# Altium schematic sheet STM32H7 Board.SchDoc
size C; SheetNumber: 1; SheetTotal: 4
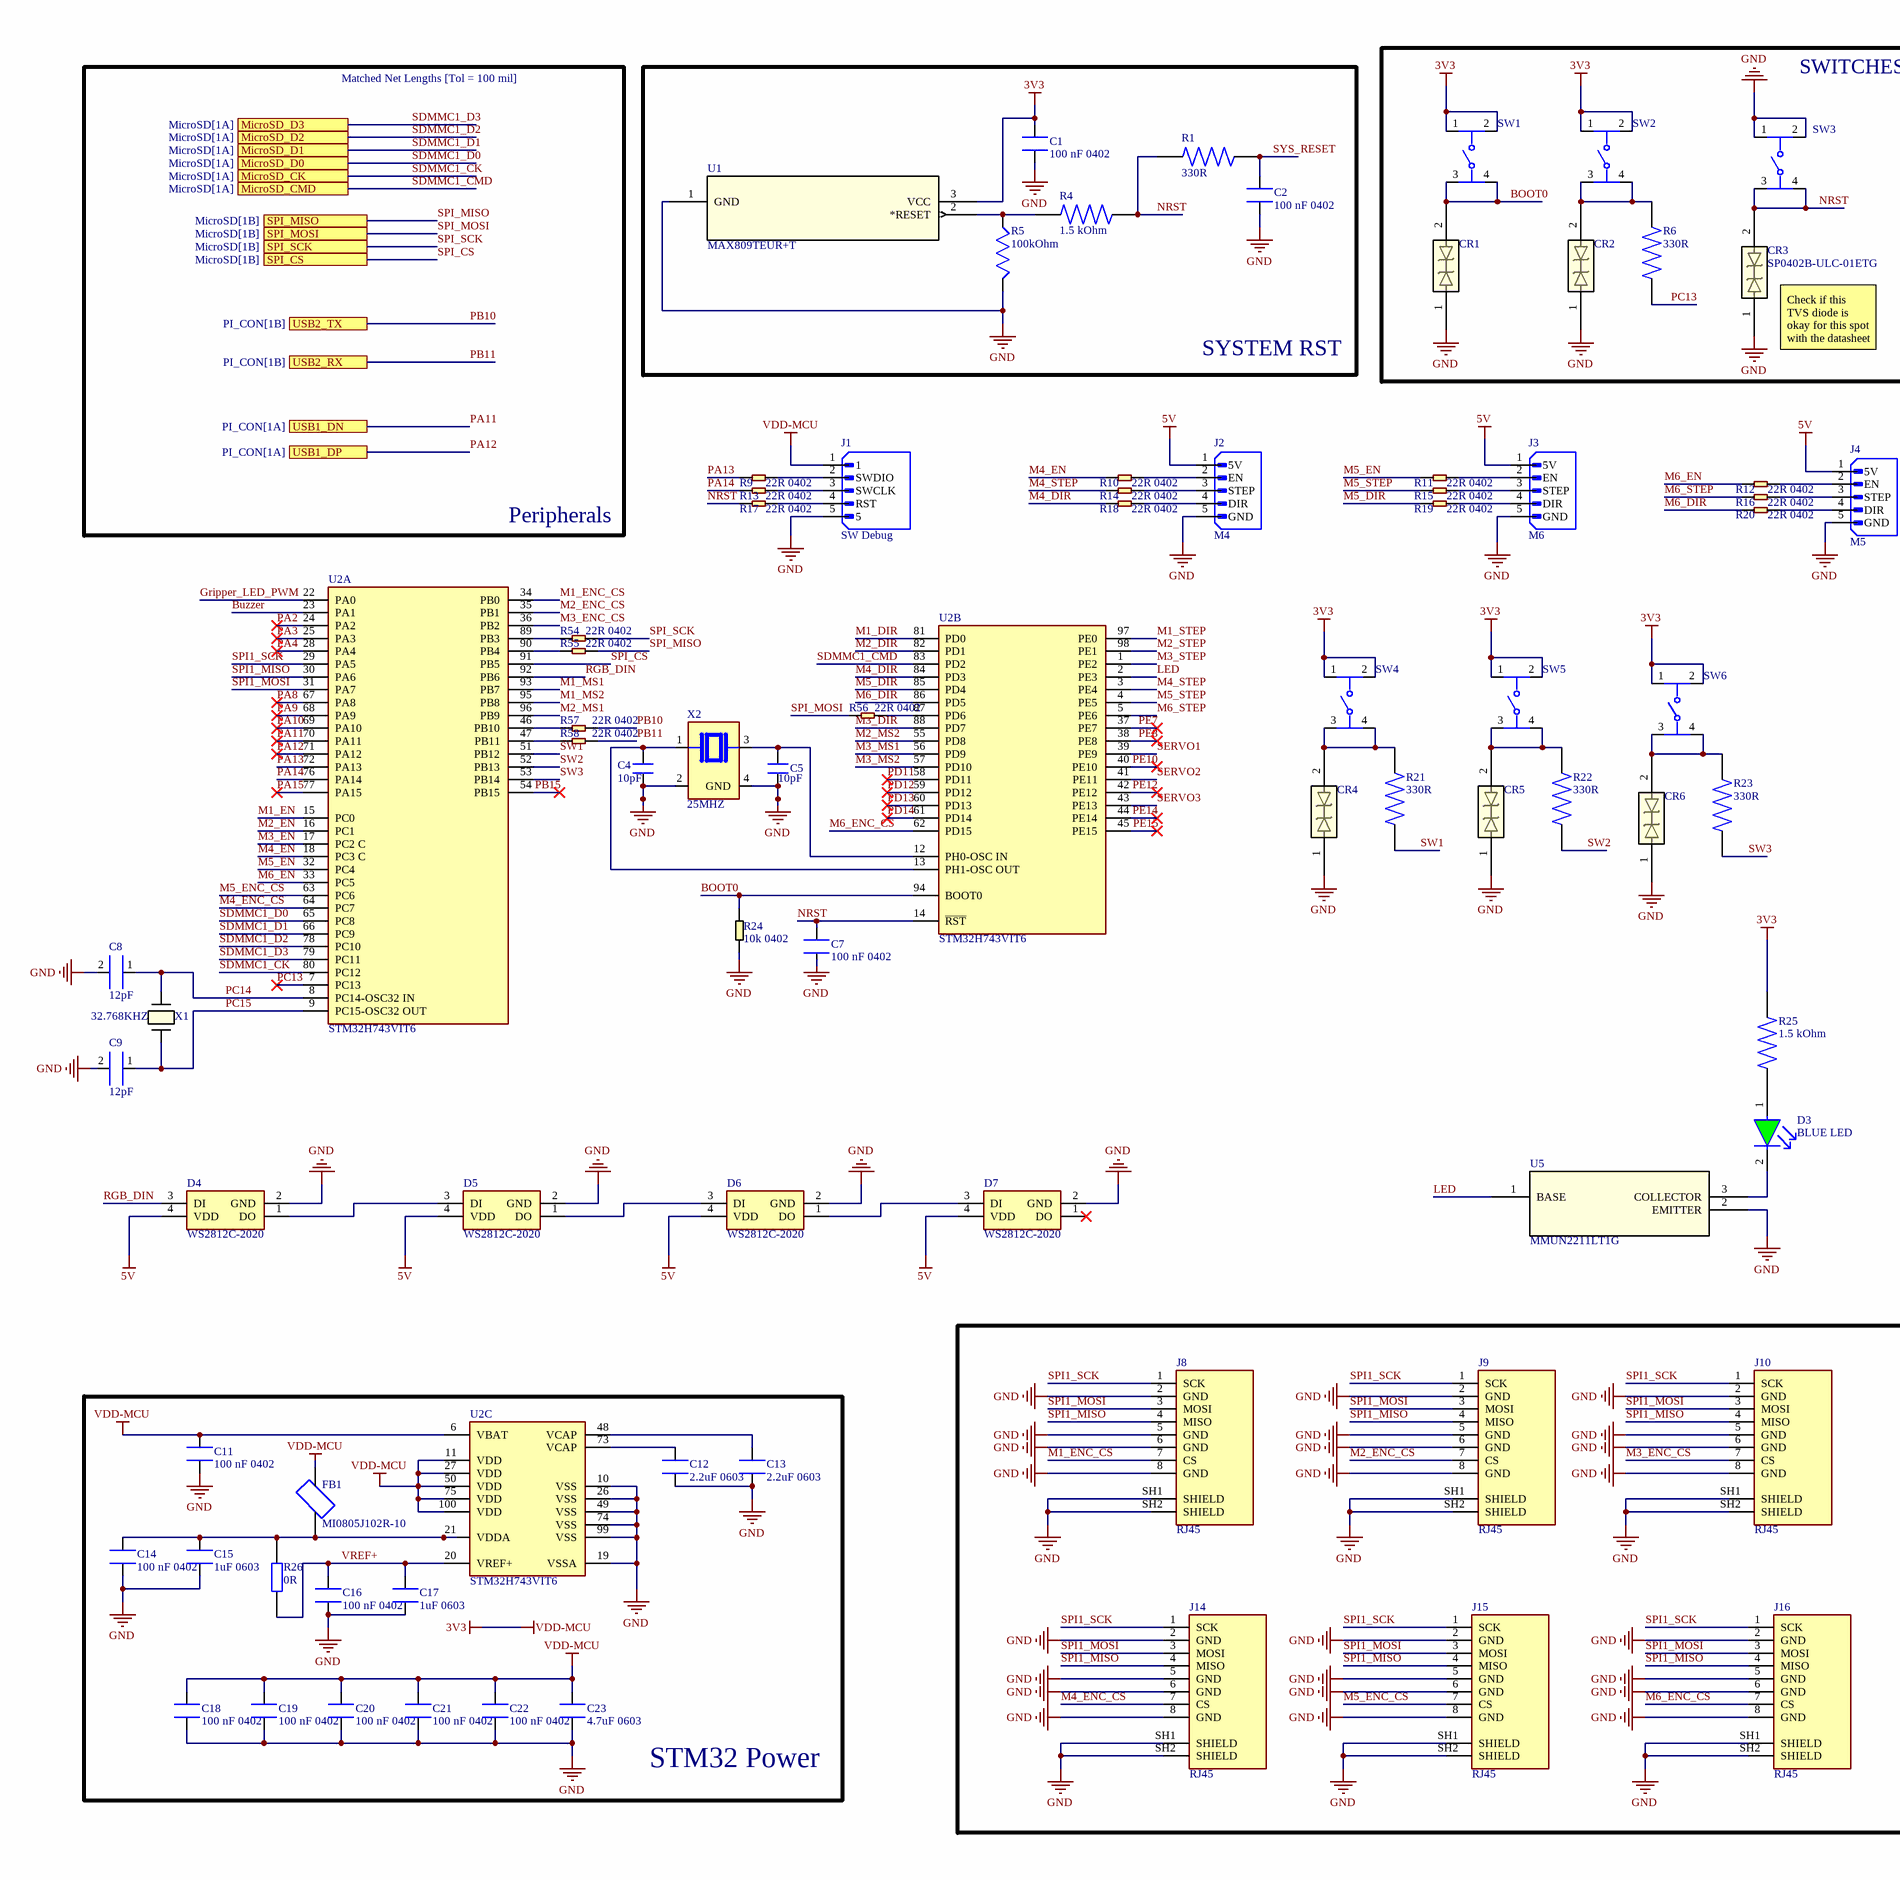
[diagram p0: STM32H7 Board.SchDoc, left]
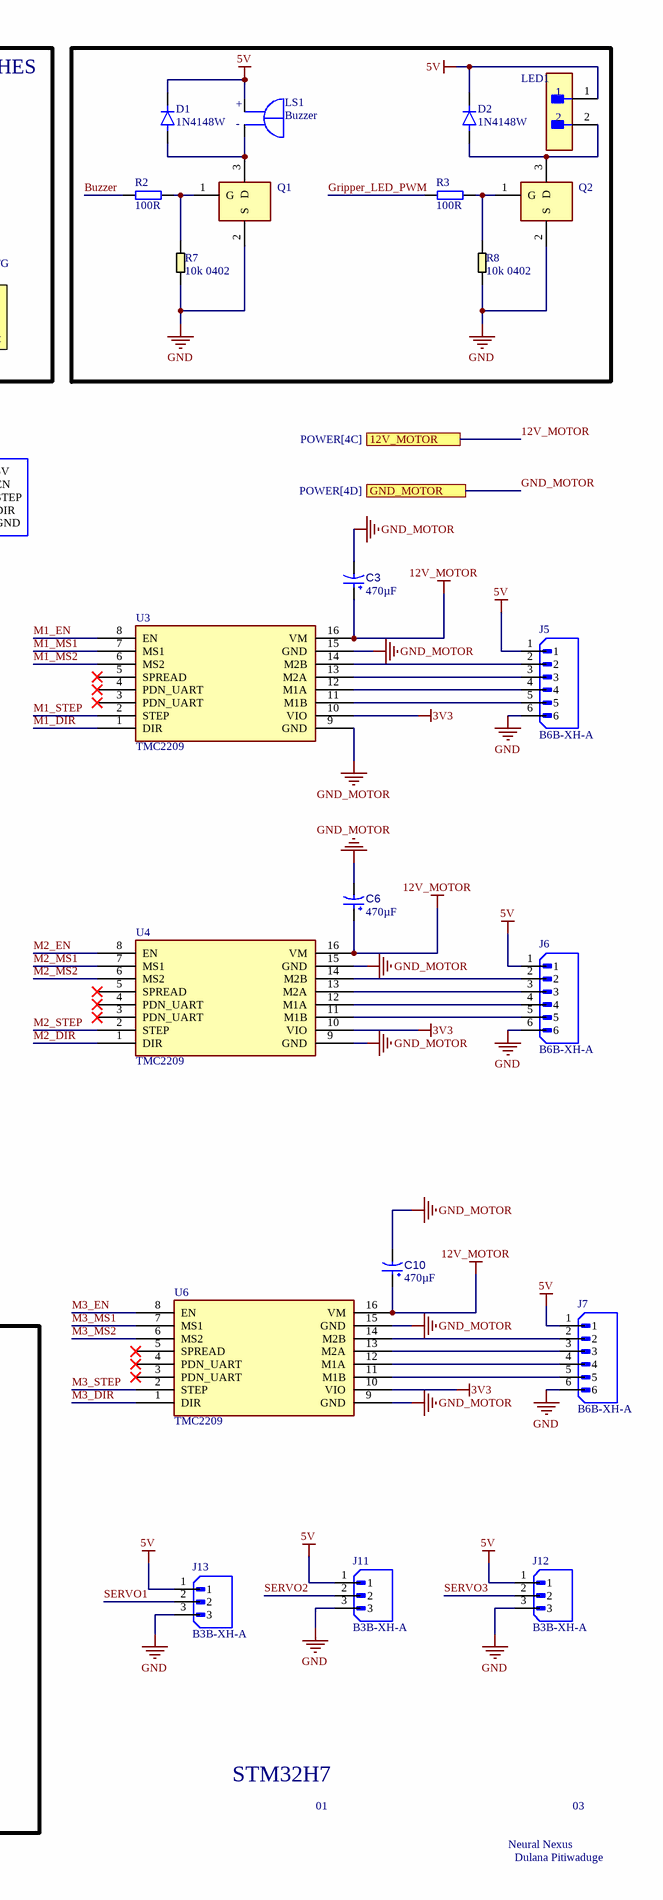
[diagram p1: STM32H7 Board.SchDoc, right]

## Parts
C1  100 nF 0402  [CAPC1005X55N]
C2  100 nF 0402  [CAPC1005X55N]
C3  value 470µF  [CAPPR65-500-2000X1000X2200]  (hidden comment: ECA-1HM471)
C4  10pF  [CAPC1005X55N]
C5  10pF  [CAPC1005X55N]
C6  value 470µF  [CAPPR65-500-2000X1000X2200]  (hidden comment: ECA-1HM471)
C7  100 nF 0402  [CAPC1005X55N]
C8  12pF  [CAPC1005X55N]
C9  12pF  [CAPC1005X55N]
C10  value 470µF  [CAPPR65-500-2000X1000X2200]  (hidden comment: ECA-1HM471)
C11  100 nF 0402  [CAPC1005X55N]
C12  2.2uF 0603  [CAPC1608X90]
C13  2.2uF 0603  [CAPC1608X90]
C14  100 nF 0402  [CAPC1005X55N]
C15  1uF 0603  [CAPC1608X90]
C16  100 nF 0402  [CAPC1005X55N]
C17  1uF 0603  [CAPC1608X90]
C18  100 nF 0402  [CAPC1005X55N]
C19  100 nF 0402  [CAPC1005X55N]
C20  100 nF 0402  [CAPC1005X55N]
C21  100 nF 0402  [CAPC1005X55N]
C22  100 nF 0402  [CAPC1005X55N]
C23  4.7uF 0603  [CAP_CC0603_YAG]
CR1  SP0402B-ULC-01ETG  [SP0402_LTF]  (value not drawn)
CR2  SP0402B-ULC-01ETG  [SP0402_LTF]  (value not drawn)
CR3  SP0402B-ULC-01ETG  [SP0402_LTF]
CR4  SP0402B-ULC-01ETG  [SP0402_LTF]  (value not drawn)
CR5  SP0402B-ULC-01ETG  [SP0402_LTF]  (value not drawn)
CR6  SP0402B-ULC-01ETG  [SP0402_LTF]  (value not drawn)
D1  1N4148W  [SODFL3816X120N]
D2  1N4148W  [SODFL3816X120N]
D3  BLUE LED  [FP-SML-LX0805SRC-TR-MFG]
D4  WS2812C-2020  [WS2812C2020]
D5  WS2812C-2020  [WS2812C2020]
D6  WS2812C-2020  [WS2812C2020]
D7  WS2812C-2020  [WS2812C2020]
FB1  MI0805J102R-10  [FB_MI0805J102R-10]
J1  SW Debug  [61300511121]
J2  M4  [JST_B5B-XH-A]
J3  M6  [JST_B5B-XH-A]
J4  M5  [JST_B5B-XH-A]
J5  B6B-XH-A  [JST_B6B-XH-A]
J6  B6B-XH-A  [JST_B6B-XH-A]
J7  B6B-XH-A  [JST_B6B-XH-A]
J8  RJ45  [AMPHENOL_RJHSE5380]
J9  RJ45  [AMPHENOL_RJHSE5380]
J10  RJ45  [AMPHENOL_RJHSE5380]
J11  B3B-XH-A  [JST_B3B-XH-A]
J12  B3B-XH-A  [JST_B3B-XH-A]
J13  B3B-XH-A  [JST_B3B-XH-A]
J14  RJ45  [AMPHENOL_RJHSE5380]
J15  RJ45  [AMPHENOL_RJHSE5380]
J16  RJ45  [AMPHENOL_RJHSE5380]
LED1  B2B-XH-A(LF)(SN)  [FP-B2B-XH-A_LF_SN-MFG]  (value not drawn)
LS1  Buzzer  [XDCR_KPEG242-5V]
Q1  2N7002LT3G  [SOT96P237X111-3N]  (value not drawn)
Q2  2N7002LT3G  [SOT96P237X111-3N]  (value not drawn)
R1  330R  [RESC1005X40N]
R2  100R  [RESC1005X40]
R3  100R  [RESC1005X40]
R4  1.5 kOhm  [RESC1005X40N]
R5  100kOhm  [RESC1005X40]
R6  330R  [RESC1005X40N]
R7  10k 0402  [RESC1005X40N]
R8  10k 0402  [RESC1005X40N]
R9  22R 0402  [R0402]
R10  22R 0402  [R0402]
R11  22R 0402  [R0402]
R12  22R 0402  [R0402]
R13  22R 0402  [R0402]
R14  22R 0402  [R0402]
R15  22R 0402  [R0402]
R16  22R 0402  [R0402]
R17  22R 0402  [R0402]
R18  22R 0402  [R0402]
R19  22R 0402  [R0402]
R20  22R 0402  [R0402]
R21  330R  [RESC1005X40N]
R22  330R  [RESC1005X40N]
R23  330R  [RESC1005X40N]
R24  10k 0402  [RESC1005X40N]
R25  1.5 kOhm  [RESC1005X40N]
R26  0R  [RESC1608X55N]
R54  22R 0402  [R0402]
R55  22R 0402  [R0402]
R56  22R 0402  [R0402]
R57  22R 0402  [R0402]
R58  22R 0402  [R0402]
SW1  TS-1089S-02526  [SKRPANE010]  (value not drawn)
SW2  TS-1089S-02526  [SKRPANE010]  (value not drawn)
SW3  TS-1089S-02526  [SKRPANE010]  (value not drawn)
SW4  TS-1089S-02526  [SKRPANE010]  (value not drawn)
SW5  TS-1089S-02526  [SKRPANE010]  (value not drawn)
SW6  TS-1089S-02526  [SKRPANE010]  (value not drawn)
U1  MAX809TEUR+T  [21-0051H_MXM]
U2  STM32H743VIT6  [FP-LQFP100-1L-MFG]  (parts A,B,C of 3)
U3  TMC2209  [TMC2209]
U4  TMC2209  [TMC2209]
U5  MMUN2211LT1G  [SOT-23-3_1P4X3P040_ONS]
U6  TMC2209  [TMC2209]
X1  32.768KHZ  [XTAL_ABS07-32.768KHZ-7-T_ABR]
X2  25MHZ  [XTAL_ABM8G-25.000MHZ-B4Y-T]

## Blocks framed on the sheet
SYSTEM RST: C1 C2 R1 R4 R5 U1
SWITCHES: CR1-CR3 R6 SW1-SW3
STM32 Power: C11-C23 FB1 R26 U2

## Ports
12V_MOTOR (see POWER[4C]), GND_MOTOR (see POWER[4D]), MicroSD_CK (see MicroSD[1A]), MicroSD_CMD (see MicroSD[1A]), MicroSD_D0 (see MicroSD[1A]), MicroSD_D1 (see MicroSD[1A]), MicroSD_D2 (see MicroSD[1A]), MicroSD_D3 (see MicroSD[1A]), SPI_CS (see MicroSD[1B]), SPI_MISO (see MicroSD[1B]), SPI_MOSI (see MicroSD[1B]), SPI_SCK (see MicroSD[1B]), USB1_DN (see PI_CON[1A]), USB1_DP (see PI_CON[1A]), USB2_RX (see PI_CON[1B]), USB2_TX (see PI_CON[1B])

## Nets
3V3: C1.2 C11.2 C18.2 C19.2 C20.2 C21.2 C22.2 C23.2 FB1.2 J1.1 R25.2 SW1.1 SW1.2 SW2.1 SW2.2 SW4.1 SW4.2 SW5.1 SW5.2 SW6.1 SW6.2 U1.3(VCC) U2.6(VBAT) U2.11(VDD) U2.27(VDD) U2.50(VDD) U2.75(VDD) U2.100(VDD) U3.10(VIO) U4.10(VIO) U6.10(VIO)  [also labelled VDD-MCU]
5V: D1.C(K) D2.C(K) D4.4(VDD) D5.4(VDD) D6.4(VDD) D7.4(VDD) J2.1(5V) J3.1(5V) J4.1(5V) J5.1 J6.1 J7.1 J11.1 J12.1 J13.1 LED1.1 LS1.P(POS)
12V_MOTOR: C3.1 C6.1 C10.1 U3.16(VM) U4.16(VM) U6.16(VM) ; port 12V_MOTOR
GND: C1.1 C2.1 C4.2 C5.2 C7.1 C8.2 C9.2 C11.1 C12.2 C13.2 C14.1 C15.2 C16.1 C17.2 C18.1 C19.1 C20.1 C21.1 C22.1 C23.1 CR1.1 CR2.1 CR3.1 CR4.1 CR5.1 CR6.1 D4.2(GND) D5.2(GND) D6.2(GND) D7.2(GND) J1.5 J2.5(GND) J3.5(GND) J4.5(GND) J5.6 J6.6 J7.6 J8.2(GND) J8.5(GND) J8.6(GND) J8.8(GND) J8.SH1(SHIELD) J8.SH2(SHIELD) J9.2(GND) J9.5(GND) J9.6(GND) J9.8(GND) J9.SH1(SHIELD) J9.SH2(SHIELD) J10.2(GND) J10.5(GND) J10.6(GND) J10.8(GND) J10.SH1(SHIELD) J10.SH2(SHIELD) J11.3 J12.3 J13.3 J14.2(GND) J14.5(GND) J14.6(GND) J14.8(GND) J14.SH1(SHIELD) J14.SH2(SHIELD) J15.2(GND) J15.5(GND) J15.6(GND) J15.8(GND) J15.SH1(SHIELD) J15.SH2(SHIELD) J16.2(GND) J16.5(GND) J16.6(GND) J16.8(GND) J16.SH1(SHIELD) J16.SH2(SHIELD) Q1.2(S) Q2.2(S) R5.1 R7.1 R8.1 R24.1 SW3.1 SW3.2 U1.1(GND) U2.10(VSS) U2.19(VSSA) U2.26(VSS) U2.49(VSS) U2.74(VSS) U2.99(VSS) U5.2(EMITTER) X2.2(GND) X2.4(GND)
GND_MOTOR: C3.2 C6.2 C10.2 U3.9(GND) U3.15(GND) U4.9(GND) U4.15(GND) U6.9(GND) U6.15(GND) ; port GND_MOTOR
BOOT0: CR1.2 R24.2 SW1.3 SW1.4 U2.94(BOOT0)
Buzzer: R2.1 U2.23(PA1)
Gripper_LED_PWM: R3.1 U2.22(PA0)
LED: U2.2(PE3) U5.1(BASE)
M1_DIR: U2.81(PD0) U3.1(DIR)
M1_EN: U2.15(PC0) U3.8(EN)
M1_ENC_CS: J8.7(CS) U2.34(PB0)
M1_MS1: U2.93(PB7) U3.7(MS1)
M1_MS2: U2.95(PB8) U3.6(MS2)
M1_STEP: U2.97(PE0) U3.2(STEP)
M2_DIR: U2.82(PD1) U4.1(DIR)
M2_EN: U2.16(PC1) U4.8(EN)
M2_ENC_CS: J9.7(CS) U2.35(PB1)
M2_MS1: U2.96(PB9) U4.7(MS1)
M2_MS2: U2.55(PD8) U4.6(MS2)
M2_STEP: U2.98(PE1) U4.2(STEP)
M3_DIR: U2.88(PD7) U6.1(DIR)
M3_EN: U2.17(PC2_C) U6.8(EN)
M3_ENC_CS: J10.7(CS) U2.36(PB2)
M3_MS1: U2.56(PD9) U6.7(MS1)
M3_MS2: U2.57(PD10) U6.6(MS2)
M3_STEP: U2.1(PE2) U6.2(STEP)
M4_DIR: R18.1 U2.84(PD3)
M4_EN: R10.1 U2.18(PC3_C)
M4_ENC_CS: J14.7(CS) U2.64(PC7)
M4_STEP: R14.1 U2.3(PE4)
M5_DIR: R19.1 U2.85(PD4)
M5_EN: R11.1 U2.32(PC4)
M5_ENC_CS: J15.7(CS) U2.63(PC6)
M5_STEP: R15.1 U2.4(PE5)
M6_DIR: R20.1 U2.86(PD5)
M6_EN: R12.1 U2.33(PC5)
M6_ENC_CS: J16.7(CS) U2.62(PD15)
M6_STEP: R16.1 U2.5(PE6)
NRST: C7.2 CR3.2 R1.1 R4.2 R17.1 SW3.3 SW3.4 U2.14(~{RST})
PA2: U2.24(PA2)
PA3: U2.25(PA3)
PA4: U2.28(PA4)
PA8: U2.67(PA8)
PA9: U2.68(PA9)
PA10: U2.69(PA10)
PA11: U2.70(PA11) ; port USB1_DN
PA12: U2.71(PA12) ; port USB1_DP
PA13: R9.1 U2.72(PA13)
PA14: R13.1 U2.76(PA14)
PA15: U2.77(PA15)
PB10: R57.2 ; port USB2_TX
PB11: R58.2 ; port USB2_RX
PB15: U2.54(PB15)
PC13: R6.1 U2.7(PC13)
PC14: C8.1 U2.8(PC14-OSC32_IN) X1.2
PC15: C9.1 U2.9(PC15-OSC32_OUT) X1.1
PD11: U2.58(PD11)
PD12: U2.59(PD12)
PD13: U2.60(PD13)
PD14: U2.61(PD14)
PE7: U2.37(PE7)
PE8: U2.38(PE8)
PE10: U2.40(PE10)
PE12: U2.42(PE12)
PE14: U2.44(PE14)
PE15: U2.45(PE15)
RGB_DIN: D4.3(DI) U2.92(PB6)
SDMMC1_CK: U2.80(PC12) ; port MicroSD_CK
SDMMC1_CMD: U2.83(PD2) ; port MicroSD_CMD
SDMMC1_D0: U2.65(PC8) ; port MicroSD_D0
SDMMC1_D1: U2.66(PC9) ; port MicroSD_D1
SDMMC1_D2: U2.78(PC10) ; port MicroSD_D2
SDMMC1_D3: U2.79(PC11) ; port MicroSD_D3
SERVO1: J13.2 U2.39(PE9)
SERVO2: J11.2 U2.41(PE11)
SERVO3: J12.2 U2.43(PE13)
SPI1_MISO: J8.4(MISO) J9.4(MISO) J10.4(MISO) J14.4(MISO) J15.4(MISO) J16.4(MISO) U2.30(PA6)
SPI1_MOSI: J8.3(MOSI) J9.3(MOSI) J10.3(MOSI) J14.3(MOSI) J15.3(MOSI) J16.3(MOSI) U2.31(PA7)
SPI1_SCK: J8.1(SCK) J9.1(SCK) J10.1(SCK) J14.1(SCK) J15.1(SCK) J16.1(SCK) U2.29(PA5)
SPI_CS: U2.91(PB5) ; port SPI_CS
SPI_MISO: R55.2 ; port SPI_MISO
SPI_MOSI: R56.1 ; port SPI_MOSI
SPI_SCK: R54.2 ; port SPI_SCK
SW1: R21.1 U2.51(PB12)
SW2: R22.1 U2.52(PB13)
SW3: R23.1 U2.53(PB14)
SYS_RESET: C2.2 R1.2
VREF+: C16.2 C17.1 R26.1 U2.20(VREF+)
NetC4_1: C4.1 U2.13(PH1-OSC_OUT) X2.1
NetC5_1: C5.1 U2.12(PH0-OSC_IN) X2.3
NetC12_1: C12.1 U2.73(VCAP)
NetC13_1: C13.1 U2.48(VCAP)
NetC14_2: C14.2 C15.1 FB1.1 R26.2 U2.21(VDDA)
NetCR2_2: CR2.2 R6.2 SW2.3 SW2.4
NetCR4_2: CR4.2 R21.2 SW4.3 SW4.4
NetCR5_2: CR5.2 R22.2 SW5.3 SW5.4
NetCR6_2: CR6.2 R23.2 SW6.3 SW6.4
NetD1_A: D1.A LS1.N(NEG) Q1.3(D)
NetD2_A: D2.A LED1.2 Q2.3(D)
NetD3_1: D3.1(A) R25.1
NetD3_2: D3.2(C) U5.3(COLLECTOR)
NetD4_1: D4.1(DO) D5.3(DI)
NetD5_1: D5.1(DO) D6.3(DI)
NetD6_1: D6.1(DO) D7.3(DI)
NetJ1_2: J1.2(SWDIO) R9.2
NetJ1_3: J1.3(SWCLK) R13.2
NetJ1_4: J1.4(RST) R17.2
NetJ2_2: J2.2(EN) R10.2
NetJ2_3: J2.3(STEP) R14.2
NetJ2_4: J2.4(DIR) R18.2
NetJ3_2: J3.2(EN) R11.2
NetJ3_3: J3.3(STEP) R15.2
NetJ3_4: J3.4(DIR) R19.2
NetJ4_2: J4.2(EN) R12.2
NetJ4_3: J4.3(STEP) R16.2
NetJ4_4: J4.4(DIR) R20.2
NetJ5_2: J5.2 U3.14(M2B)
NetJ5_3: J5.3 U3.13(M2A)
NetJ5_4: J5.4 U3.12(M1A)
NetJ5_5: J5.5 U3.11(M1B)
NetJ6_2: J6.2 U4.14(M2B)
NetJ6_3: J6.3 U4.13(M2A)
NetJ6_4: J6.4 U4.12(M1A)
NetJ6_5: J6.5 U4.11(M1B)
NetJ7_2: J7.2 U6.14(M2B)
NetJ7_3: J7.3 U6.13(M2A)
NetJ7_4: J7.4 U6.12(M1A)
NetJ7_5: J7.5 U6.11(M1B)
NetQ1_1: Q1.1(G) R2.2 R7.2
NetQ2_1: Q2.1(G) R3.2 R8.2
NetR4_1: R4.1 R5.2 U1.2(*RESET)
NetR54_1: R54.1 U2.89(PB3)
NetR55_1: R55.1 U2.90(PB4)
NetR56_2: R56.2 U2.87(PD6)
NetR57_1: R57.1 U2.46(PB10)
NetR58_1: R58.1 U2.47(PB11)

Not connected (* = marked no-connect by the designer): D7 1(DO)*; U3 3(PDN_UART)* 4(PDN_UART)* 5(SPREAD)*; U4 3(PDN_UART)* 4(PDN_UART)* 5(SPREAD)*; U6 3(PDN_UART)* 4(PDN_UART)* 5(SPREAD)*

## Notes on the sheet
- Matched Net Lengths [Tol = 100 mil]
- (near CR3) Check if this TVS diode is okay for this spot with the datasheet
- Peripherals
- STM32H7
- 01
- Neural Nexus
- Dulana Pitiwaduge
- 03
- (in symbol KPEG242-5V) +; -

## Library data of the parts
C1 C2 C7 C11 C14 C16 C18-C22 = CL05B104KP5NNNC: 0.1 ÂµF Â±10% 10V Ceramic Capacitor X7R 0402 (1005 Metric); MF: Samsung Electro-Mechanics; SnapEDA_Link: https://www.snapeda.com/parts/CL05B104KP5NNNC/Samsung/view-part/?ref=snap; Package: SMD-2 Samsung; Value: *; MP: CL05B104KP5NNNC; Check_prices: https://www.snapeda.com/parts/CL05B104KP5NNNC/Samsung/view-part/?ref=eda
C3 C6 C10 = CMP-001-00032-8: Aluminum Electrolytic Capacitor, 470 uF, +/- 20%, 50 V, -40 to 85 degC, 2-Pin THD, RoHS, Bulk; Manufacturer: Panasonic; Ripple Current: 650mA; Voltage Rating: 50V; Ripple Current (AC): 650mA; Packaging: Bulk; Capacitor Type: Electrolytic; Diameter: 10mm; Datasheet URL: http://industrial.panasonic.com/cdbs/www-data/pdf/RDF0000/ABA0000C1047.pdf; Case/Package: Radial; Tolerance: 20%; Max Operating Temperature: 85°C; Pins: 2; Min Operating Temperature: -40°C; RoHS Compliant: True; Mounting Technology: TH; Package Quantity: 200; Lead Pitch: 5mm; Manufacturer URL: http://www.panasonic.com/; Package Description: 2-Pin Radial Lead, Dia 10 mm, Height 22 mm; Datasheet Version: Mar-16; Package Reference: CAPPR65-500-2000X1000X2200
C4 C5 = CC0402JRNPO8BN100: 10 pF Â±5% 25V Ceramic Capacitor C0G, NP0 0402 (1005 Metric); MF: Yageo; SnapEDA_Link: https://www.snapeda.com/parts/CC0402JRNPO8BN100/Yageo/view-part/?ref=snap; Package: 0402 Yageo; Value: *; MP: CC0402JRNPO8BN100; Check_prices: https://www.snapeda.com/parts/CC0402JRNPO8BN100/Yageo/view-part/?ref=eda
C8 C9 = GRM1555C1H120FA01D: 0402 12 pF 50 V Â±1% Tolerance C0G SMT Multilayer Ceramic Capacitor; Package: None; Price: None; Value: *; MP: GRM1555C1H120FA01D; Availability: Unavailable
C12 C13 = CC0603KRX5R8BB225: 2.2 ÂµF Â±10% 25V Ceramic Capacitor X5R 0603 (1608 Metric); MF: Yageo; SnapEDA_Link: https://www.snapeda.com/parts/CC0603KRX5R8BB225/Yageo/view-part/?ref=snap; Package: 0603 Yageo; Value: *; MP: CC0603KRX5R8BB225; Check_prices: https://www.snapeda.com/parts/CC0603KRX5R8BB225/Yageo/view-part/?ref=eda
C15 C17 = CC0603ZRY5V7BB105: 1 ÂµF -20%, +80% 16V Ceramic Capacitor Y5V (F) 0603 (1608 Metric); MF: Yageo; SnapEDA_Link: https://www.snapeda.com/parts/CC0603ZRY5V7BB105/Yageo/view-part/?ref=snap; Package: 0603 Yageo; Value: *; MP: CC0603ZRY5V7BB105; Check_prices: https://www.snapeda.com/parts/CC0603ZRY5V7BB105/Yageo/view-part/?ref=eda
C23 = CC0603MRX7R5BB475: No Description Available; Manufacturer_Name: Yageo; Copyright: Copyright (C) 2026 Ultra Librarian. All rights reserved.; Manufacturer_Part_Number: CC0603MRX7R5BB475
CR1-CR6 = SP0402B-ULC-01ETG: Description; Manufacturer_Name: Littelfuse Inc; Copyright: Copyright (C) 2025 Ultra Librarian. All rights reserved.; Manufacturer_Part_Number: SP0402B-ULC-01ETG; RefDes: RefDes; Type: Type
D1 D2 = 1N4148W: Small Signal Diode, SOD-123F, 100V, 0.15A, 150Â°C; MF: Diotec Semiconductor; SnapEDA_Link: https://www.snapeda.com/parts/1N4148W/Diotec/view-part/?ref=snap; Package: SOD-123F Diotec; Value: *; MP: 1N4148W; Check_prices: https://www.snapeda.com/parts/1N4148W/Diotec/view-part/?ref=eda
D3 = RED GREEN: LED RED CLEAR SMD; TRONIC part No: LE0011; LCSC Part Number: *
D4-D7 = WS2812C-2020: Intelligent control LED integrated light source; Manufacturer_Name: Worldsemi; Geometry.Height: 0.84mm; Manufacturer_Part_Number: WS2812C-2020; Mouser Price/Stock: *; Arrow Part Number: *; Arrow Price/Stock: *; Datasheet Link: http://www.world-semi.com/DownLoadFile/139; LCSC Part Number: C2976072
FB1 = MI0805J102R-10: EMI Ferrite Chip Bead, 0805, 1000MA, 1000 Ohms @100MHz, DCR Max 0.150Ohm | Laird Performance Materials MI0805J102R-10; MF: Laird-Signal Integrity Products; SnapEDA_Link: https://www.snapeda.com/parts/MI0805J102R-10/Laird-Signal+Integrity+Products/view-part/?ref=snap; Package: 0805 Laird; Value: *; MP: MI0805J102R-10; Check_prices: https://www.snapeda.com/parts/MI0805J102R-10/Laird-Signal+Integrity+Products/view-part/?ref=eda
J1 = B5B-XH-A: Connector Header Through Hole 5 position 0.098 (2.50mm); MF: JST Sales; SnapEDA_Link: https://www.snapeda.com/parts/B5B-XH-A/JST+Sales+America+Inc./view-part/?ref=snap; Package: None; Value: *; MP: B5B-XH-A; Check_prices: https://www.snapeda.com/parts/B5B-XH-A/JST+Sales+America+Inc./view-part/?ref=eda
J2-J4 = B5B-XH-A_1: Connector Header Through Hole 5 position 0.098 (2.50mm); MF: JST Sales; SnapEDA_Link: https://www.snapeda.com/parts/B5B-XH-A/JST+Sales+America+Inc./view-part/?ref=snap; Package: None; Value: *; MP: B5B-XH-A; Check_prices: https://www.snapeda.com/parts/B5B-XH-A/JST+Sales+America+Inc./view-part/?ref=eda
J5-J7 = B6B-XH-A: Connector Header Through Hole 6 position 0.098 (2.50mm); MF: {'manufacturer': u'JST Sales America Inc.'}; Package: None; Price: None; Value: *; MP: B6B-XH-A; Availability: Unavailable
J8-J10 J14-J16 = RJHSE5380: CONN MOD JACK 8P8C R/A SHIELDED; MF: Amphenol; Package: None; Price: None; Value: *; MP: RJHSE5380; Availability: Unavailable; LCSC Part Number: *
J11-J13 = B3B-XH-A: Connector Header Through Hole 3 position 0.098 (2.50mm); MF: JST Sales; SnapEDA_Link: https://www.snapeda.com/parts/B3B-XH-A/JST/view-part/?ref=snap; Package: None; Value: *; MP: B3B-XH-A; Check_prices: https://www.snapeda.com/parts/B3B-XH-A/JST/view-part/?ref=eda
LED1 = JST 2 pin: B2B-XH-A(LF)(SN) / CONN HEADER VERT 2POS 2.5MM; Current Rating: 3A; Voltage Rating: 250V; Number of Contacts: 2; Contact Resistance: 20mR; Wire/Cable Gauge: 22AWG; Insulation Resistance: 1GR; Color: Natural; Connector Type: Male Pin; Packaging: Bulk; Contact Material: Brass; Lead Free: Lead Free; Orientation: Straight; Contact Plating: Tin; Max Current Rating: 3A; Termination: Solder; Fastening Type: Detent; Depth: 5.75mm; Housing Material: Polyamide; REACH SVHC: No SVHC; Series: XH; Voltage Rating (AC): 250V; Number of Positions: 2; Contact Type: Male Pin; Max Voltage Rating (DC): 250V; Pitch: 2.5mm; Lead Pitch: 2.5mm; Mount: Through Hole; Max Operating Temperature: 85°C; Length: 7.4mm; Max Voltage Rating (AC): 250V; Min Operating Temperature: -25°C; Number of Rows: 1; Housing Color: White; LCSC Part No: C158012
LS1 = KPEG242-5V: Availability: Unavailable; Price: None; Package: None; Value: *; MP: KPEG242-5V
Q1 Q2 = 2N7002LT3G: RoHS Compliant; Small package discrete; Manufacturer_Name: onsemi; Geometry.Height: 1.11mm; Manufacturer_Part_Number: 2N7002LT3G; Mouser Part Number: 863-2N7002LT3G; Mouser Price/Stock: https://www.mouser.co.uk/ProductDetail/onsemi/2N7002LT3G?qs=vLkC5FC1VN%2FhV1CBpCulsw%3D%3D; Arrow Part Number: 2N7002LT3G; Arrow Price/Stock: https://www.arrow.com/en/products/2n7002lt3g/on-semiconductor?utm_currency=USD&region=nac; Datasheet Link: https://www.onsemi.com/pub/Collateral/2N7002L-D.PDF
R1 R6 R21-R23 = RC0402FR-07330RL: 330 Ohms Â±1% 0.063W, 1/16W Chip Resistor 0402 (1005 Metric) Moisture Resistant Thick Film; MF: Yageo; SnapEDA_Link: https://www.snapeda.com/parts/RC0402FR-07330RL/Yageo/view-part/?ref=snap; Package: 1005 Panasonic Electronic Components; Value: *; MP: RC0402FR-07330RL; Check_prices: https://www.snapeda.com/parts/RC0402FR-07330RL/Yageo/view-part/?ref=eda
R2 R3 = RC0402FR-07100RL: 100 Ohms Â±1% 0.063W, 1/16W Chip Resistor 0402 (1005 Metric) Moisture Resistant Thick Film; MF: Yageo; SnapEDA_Link: https://www.snapeda.com/parts/RC0402FR-07100RL/Yageo/view-part/?ref=snap; Package: 0402 Yageo; Value: *; MP: RC0402FR-07100RL; Check_prices: https://www.snapeda.com/parts/RC0402FR-07100RL/Yageo/view-part/?ref=eda
R4 R25 = RC0402FR-071K5L: 1.5 kOhms Â±1% 0.063W, 1/16W Chip Resistor 0402 (1005 Metric) Moisture Resistant Thick Film; MF: Yageo; SnapEDA_Link: https://www.snapeda.com/parts/RC0402FR-071K5L/Yageo/view-part/?ref=snap; Package: 1005 Panasonic Electronic Components; Value: *; MP: RC0402FR-071K5L; Check_prices: https://www.snapeda.com/parts/RC0402FR-071K5L/Yageo/view-part/?ref=eda
R5 = RC0402FR-07100KL: 100 kOhms Â±1% 0.063W, 1/16W Chip Resistor 0402 (1005 Metric) Moisture Resistant Thick Film; MF: Yageo; SnapEDA_Link: https://www.snapeda.com/parts/RC0402FR-07100KL/Yageo/view-part/?ref=snap; Package: 0402 Yageo; Value: *; MP: RC0402FR-07100KL; Check_prices: https://www.snapeda.com/parts/RC0402FR-07100KL/Yageo/view-part/?ref=eda
R7 R8 R24 = SMD-RES-10K-5%-1/(0402): 301010004; MF: {'manufacturer': u'YAGEO'}; MP: RC0402JR-0710KL; Package: None; Price: None; Value: *; Availability: Unavailable
R9-R20 R54-R58 = SMD-RES-22R-1%-1/16W(0402): 22 Ohms Â±1% 0.063W, 1/16W Chip Resistor 0402 (1005 Metric) Moisture Resistant Thick Film; MF: Yageo; MP: RC0402FR-0722RL; SnapEDA_Link: https://www.snapeda.com/parts/RC0402FR-0722RL/Yageo/view-part/?ref=snap; Package: 0402 Yageo; Value: *; Check_prices: https://www.snapeda.com/parts/RC0402FR-0722RL/Yageo/view-part/?ref=eda
  R54-R58: LCSC Part Number: *
R26 = CR0603AJ/-000EAS: Resistor, AS 0603 0R Jumper 100mW, AEC-Q, Anti-Sulur | Bourns CR0603AJ/-000EAS; MF: Bourns Inc.; SnapEDA_Link: https://www.snapeda.com/parts/CR0603AJ/-000EAS/Bourns/view-part/?ref=snap; Package: 0603-2 Bourns; Value: *; MP: CR0603AJ/-000EAS; Check_prices: https://www.snapeda.com/parts/CR0603AJ/-000EAS/Bourns/view-part/?ref=eda
SW1-SW6 = TS-1089S-02526: Tactile Switch SPST 2.5mm 4.2mm x 3.25mm Surface Mount; Manufacturer_Name: ALPS Electric; Manufacturer_Part_Number: TS-1089S-02526; LCSC Part Number: C455282; Arrow Part Number: *; Arrow Price/Stock: *; Datasheet Link: https://tech.alpsalpine.com/e/products/detail/SKRPANE010/#ancFig2; Geometry.Height: 2.5mm
U1 = MAX809TEUR+T_1: 3-Pin Microprocessor Reset Circuits; Manufacturer_Name: Analog Devices Inc; Copyright: Copyright (C) 2026 Ultra Librarian. All rights reserved.; Manufacturer_Part_Number: MAX809TEUR+T; RefDes: RefDes; Type: Type
U2 = CMP-12105-000050-1: IC MCU 32BIT 2MB FLASH 100LQFP; Manufacturer: STMicroelectronics; Number Of Ethernet Channels: 1; Number Of Usb Channels: 2; Number Of A/D Converters: 3; Min Supply Voltage: 1.71V; Ram Size: 1060KBytes; Number Of I2C Channels: 4; Frequency: 480MHz; Number Of Adc Channels: 36; Number Of I/Os: 82; Max Supply Voltage: 3.6V; Number Of Spi Channels: 6; Memory Size: 2MBytes; Max Junction Temp: +125°C; Core Architecture: Arm Cortex-M7; Interface: I2C,SPI,UART,USART,USB,LIN,IrDA,Ethernet,I2S,Other; Number Of Timers/Counters: 20; Data Bus Width: 32bits; Number Of Pwm Channels: 42; Number Of Uart Channels: 9; Standoff Height: 0.05mm; Device Class L1: Integrated Circuits (ICs); ComponentLink2URL: https://www.st.com/resource/en/datasheet/stm32h743vi.pdf; Automotive: No; Memory Type: FLASH; Number Of Cores: 1; Temperature Range Low: -40°C; RoHS: TRUE; Ambient Temperature Range Low: -40°C; ComponentLink2Description: Datasheet; Device Class L2: Embedded Processors and Controllers; Device Class L3: Microcontrollers; Digikey Description: IC MCU 32BIT 2MB FLASH 100LQFP; Temperature Range High: +125°C; Ambient Temperature Range High: +85°C; Package: LQFP100-1L; Temperature: -40°C to +125°C; Category: IC; Ipc Land Pattern Name: QFP50P1600X1600X160-100; Height: 1.6mm; Manufacturer Part Number: STM32H743VIT6; Octopart: https://octopart.com/stm32h743vit6-stmicroelectronics-76372527; Lead Free: Yes
U5 = MMUN2211LT1G: TRANS PREBIAS NPN 50V SOT23-3; Manufacturer_Name: onsemi; Copyright: Copyright (C) 2025 Ultra Librarian. All rights reserved.; Manufacturer_Part_Number: MMUN2211LT1G; RefDes: RefDes; Type: Type
X1 = ABS07-32.768KHZ-7-T: Description; Manufacturer_Name: Abracon; Copyright: Copyright (C) 2025 Ultra Librarian. All rights reserved.; Manufacturer_Part_Number: ABS07-32.768KHZ-7-T
X2 = ABM8G-25.000MHZ-B4Y-T: 25 MHz Â±30ppm Crystal 10pF 60 Ohms 4-SMD, No Lead; MF: Abracon; Value: *; SnapEDA_Link: https://www.snapeda.com/parts/ABM8G-25.000MHZ-B4Y-T/Abracon+LLC/view-part/?ref=snap; MP: ABM8G-25.000MHZ-B4Y-T; Check_prices: https://www.snapeda.com/parts/ABM8G-25.000MHZ-B4Y-T/Abracon+LLC/view-part/?ref=eda; Availability: In Stock; Price: None; Purchase-URL: https://pricing.snapeda.com/search/part/ABM8G-25.000MHZ-B4Y-T/?ref=eda; Package: SMD-4 Abracon